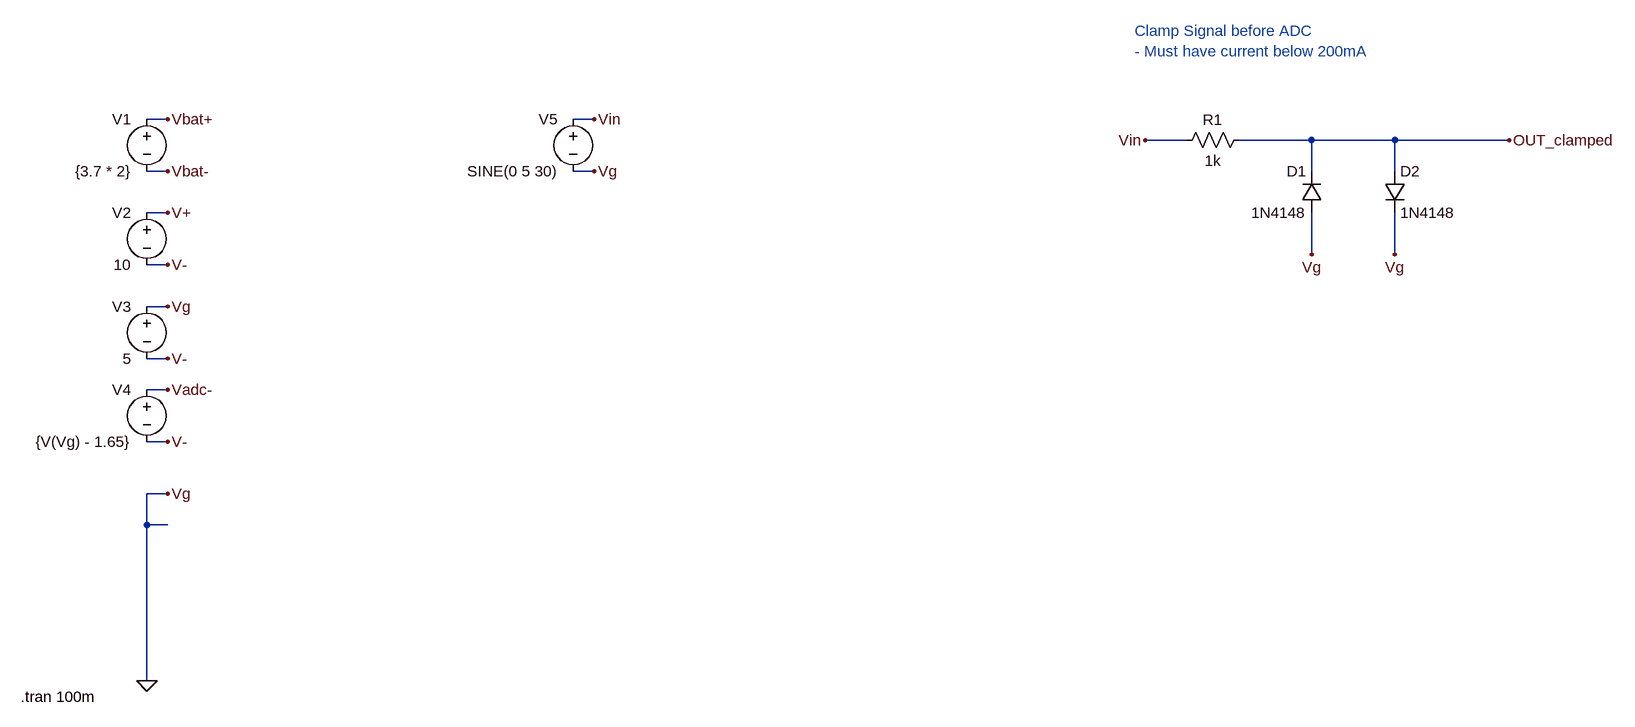
[diagram p0: schematic capstone_clamp_final.asc]
capstone_clamp_final.asc, the LTspice schematic file:
Version 4
SHEET 1 880 680
WIRE -1520 -528 -1552 -528
WIRE -864 -528 -896 -528
WIRE 48 -496 -16 -496
WIRE 240 -496 128 -496
WIRE 368 -496 240 -496
WIRE 544 -496 368 -496
WIRE -1520 -448 -1552 -448
WIRE -864 -448 -896 -448
WIRE 240 -448 240 -496
WIRE 368 -448 368 -496
WIRE -1520 -384 -1552 -384
WIRE 240 -320 240 -384
WIRE 368 -320 368 -384
WIRE -1520 -304 -1552 -304
WIRE -1520 -240 -1552 -240
WIRE -1520 -160 -1552 -160
WIRE -1520 -112 -1552 -112
WIRE -1520 -32 -1552 -32
WIRE -1520 48 -1552 48
WIRE -1552 96 -1552 48
WIRE -1520 96 -1552 96
WIRE -1552 336 -1552 96
FLAG 544 -496 OUT_clamped
FLAG -1520 -528 Vbat+
FLAG -1520 -448 Vbat-
FLAG -1520 -384 V+
FLAG -1520 -304 V-
FLAG -1520 -240 Vg
FLAG -1520 -160 V-
FLAG -1520 -112 Vadc-
FLAG -1520 -32 V-
FLAG -1552 336 0
FLAG 240 -320 Vg
FLAG 368 -320 Vg
FLAG -16 -496 Vin
FLAG -864 -448 Vg
FLAG -864 -528 Vin
FLAG -1520 48 Vg
SYMBOL res 144 -512 R90
WINDOW 0 0 56 VBottom 2
WINDOW 3 32 56 VTop 2
SYMATTR InstName R1
SYMATTR Value 1k
SYMBOL diode 256 -384 R180
WINDOW 0 24 64 Left 2
WINDOW 3 24 0 Left 2
SYMATTR InstName D1
SYMATTR Value 1N4148
SYMBOL diode 352 -448 R0
SYMATTR InstName D2
SYMATTR Value 1N4148
SYMBOL voltage -1552 -544 M0
SYMATTR InstName V1
SYMATTR Value {3.7 * 2}
SYMBOL voltage -1552 -400 M0
SYMATTR InstName V2
SYMATTR Value 10
SYMBOL voltage -1552 -256 M0
SYMATTR InstName V3
SYMATTR Value 5
SYMBOL voltage -1552 -128 M0
SYMATTR InstName V4
SYMATTR Value {V(Vg) - 1.65}
SYMBOL voltage -896 -544 M0
WINDOW 123 0 0 Left 0
WINDOW 39 0 0 Left 0
SYMATTR InstName V5
SYMATTR Value SINE(0 5 30)
TEXT -32 -664 Left 2 ;Clamp Signal before ADC\n- Must have current below 200mA
TEXT -1746 360 Left 2 !.tran 100m

The netlist it stands for:
* capstone_clamp_final.asc
R1 OUT_clamped Vin 1k
D1 0 OUT_clamped 1N4148
D2 OUT_clamped 0 1N4148
V1 Vbat+ Vbat- {3.7 * 2}
V2 V+ V- 10
V3 0 V- 5
V4 Vadc- V- {V(Vg) - 1.65}
V5 Vin 0 SINE(0 5 30)
.model D D
.lib standard.dio
* Clamp Signal before ADC
* - Must have current below 200mA
.tran 100m
.backanno
.end